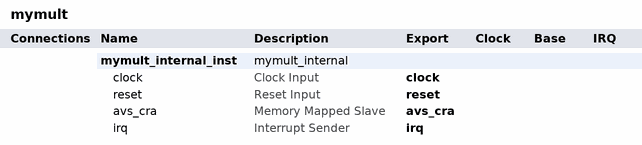
[diagram p0: system contents]
# Platform Designer (Qsys) system mymult, Cyclone V 5CSEBA6U23I7
# Parameters at their usual value, and those the tool derives, are not listed.
package require qsys
create_system mymult
set_project_property DEVICE_FAMILY {Cyclone V}
set_project_property DEVICE 5CSEBA6U23I7

add_instance mymult_internal_inst mymult_internal 1.0
set_instance_property mymult_internal_inst AUTO_EXPORT true

# exported interfaces
add_interface avs_cra avalon slave
set_interface_property avs_cra EXPORT_OF mymult_internal_inst.avs_cra
add_interface clock clock sink
set_interface_property clock EXPORT_OF mymult_internal_inst.clock
add_interface irq interrupt sender
set_interface_property irq EXPORT_OF mymult_internal_inst.irq
add_interface reset reset sink
set_interface_property reset EXPORT_OF mymult_internal_inst.reset

set_interconnect_requirement {$system} qsys_mm.clockCrossingAdapter HANDSHAKE
set_interconnect_requirement {$system} qsys_mm.enableEccProtection FALSE
set_interconnect_requirement {$system} qsys_mm.insertDefaultSlave FALSE
set_interconnect_requirement {$system} qsys_mm.maxAdditionalLatency 1

save_system mymult.qsys
